# EAGLE design pro-one-filter-and-envelopes (EAGLE 5.07)
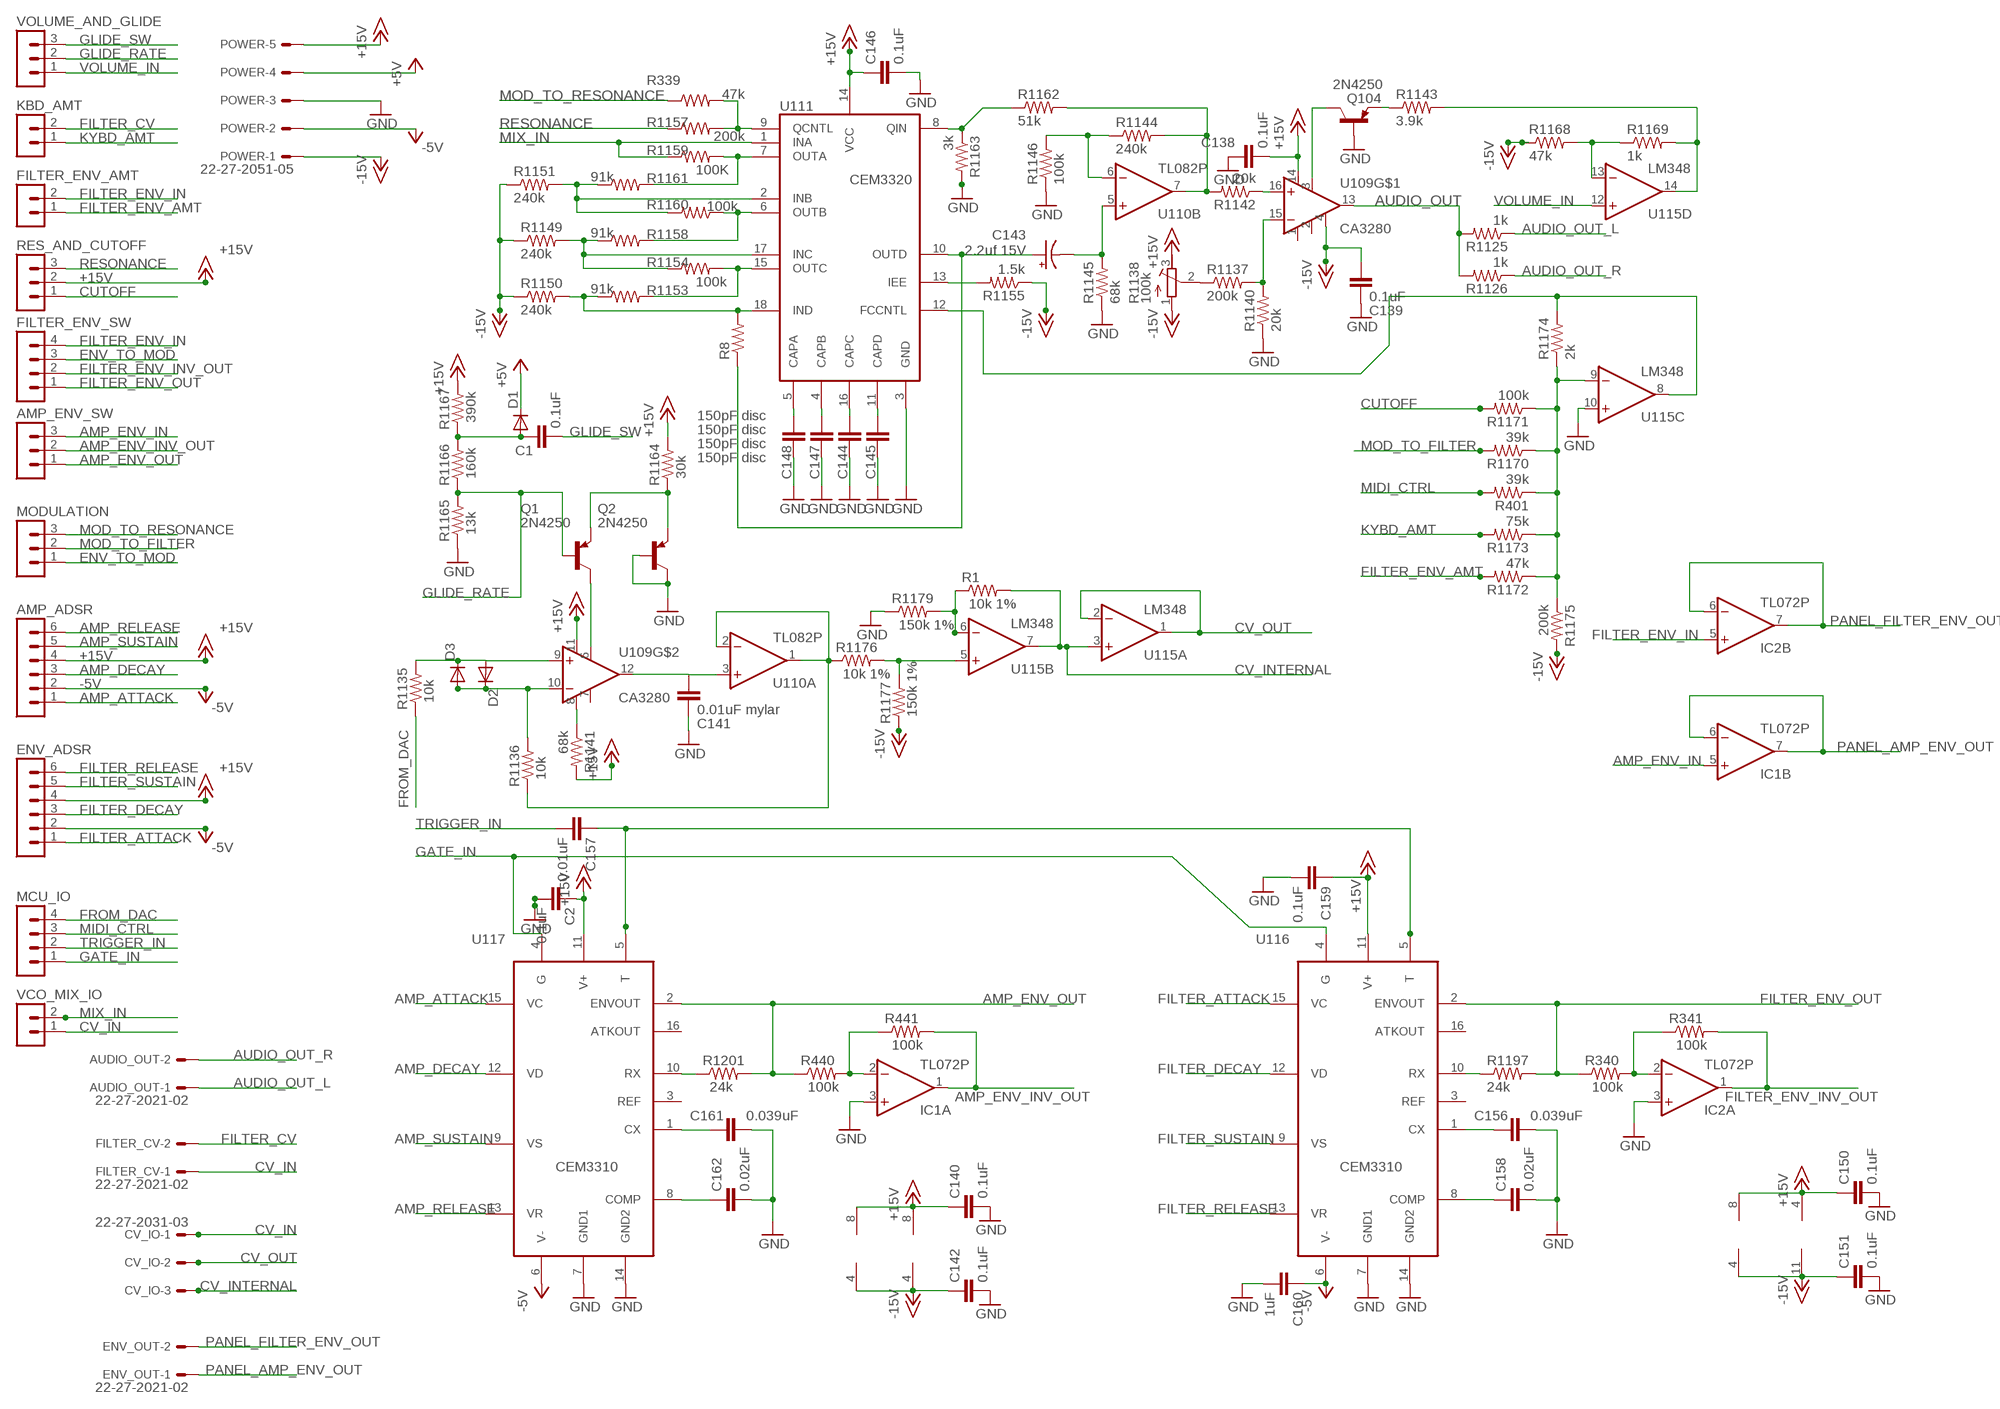
[diagram p0: schematic, sheet 1]

## Parts
AMP_ADSR  MA06-1  [MA06-1]
AMP_ENV_SW  MA03-1  [MA03-1]
AUDIO_OUT  22-27-2021-02  [6410-02]
C1  0.1uF  C-EU050-025X075  [C050-025X075]
C2  0.1uF  C-EU050-025X075  [C050-025X075]
C138  0.1uF  C-EU050-025X075  [C050-025X075]
C139  0.1uF  C-EU050-025X075  [C050-025X075]
C140  0.1uF  C-EU050-025X075  [C050-025X075]
C141  0.01uF mylar  C-EU050-025X075  [C050-025X075]
C142  0.1uF  C-EU050-025X075  [C050-025X075]
C143  2.2uf 15V  CPOL-USE2.5-5  [E2,5-5]
C144  150pF disc  C-EU025-025X050  [C025-025X050]
C145  150pF disc  C-EU025-025X050  [C025-025X050]
C146  0.1uF  C-EU025-025X050  [C025-025X050]
C147  150pF disc  C-EU025-025X050  [C025-025X050]
C148  150pF disc  C-EU025-025X050  [C025-025X050]
C150  0.1uF  C-EU050-025X075  [C050-025X075]
C151  0.1uF  C-EU050-025X075  [C050-025X075]
C156  0.039uF  C-EU050-025X075  [C050-025X075]
C157  0.01uF  C-EU050-025X075  [C050-025X075]
C158  0.02uF  C-EU050-025X075  [C050-025X075]
C159  0.1uF  C-EU050-025X075  [C050-025X075]
C160  1uF  C-EU050-025X075  [C050-025X075]
C161  0.039uF  C-EU050-025X075  [C050-025X075]
C162  0.02uF  C-EU050-025X075  [C050-025X075]
CV_IO  22-27-2031-03  [6410-03]
D1  1N4148DO35-7  [DO35-7]
D2  1N4148DO35-10  [DIODE_STANDING]
D3  1N4148DO35-10  [DIODE_STANDING]
ENV_ADSR  MA06-1  [MA06-1]
ENV_OUT  22-27-2021-02  [6410-02]
FILTER_CV  22-27-2021-02  [6410-02]
FILTER_ENV_AMT  MA02-1  [MA02-1]
FILTER_ENV_SW  MA04-1  [MA04-1]
IC1  TL072P  [DIL08]
IC2  TL072P  [DIL08]
KBD_AMT  MA02-1  [MA02-1]
MCU_IO  MA04-1  [MA04-1]
MODULATION  MA03-1  [MA03-1]
POWER  22-27-2051-05  [6410-05]
Q1  2N4250  [TO92]
Q2  2N4250  [TO92]
Q104  2N4250  [TO92]
R1  10k 1%  R-US_0204/2V  [0204V]
R8  R-US_0204/5  [0204/5]
R339  47k  R-US_0309/10  [0309/10]
R340  100k  R-US_0309/10  [0309/10]
R341  100k  R-US_0309/10  [0309/10]
R401  39k  R-US_0309/10  [0309/10]
R440  100k  R-US_0309/10  [0309/10]
R441  100k  R-US_0309/10  [0309/10]
R1125  1k  R-US_0204/2V  [0204V]
R1126  1k  R-US_0204/2V  [0204V]
R1135  10k  R-US_0204/2V  [0204V]
R1136  10k  R-US_0309/10  [0309/10]
R1137  200k  R-US_0204/2V  [0204V]
R1138  100k  R-TRIMM64W  [RTRIM64W]
R1140  20k  R-US_0204/2V  [0204V]
R1141  68k  R-US_0309/10  [0309/10]
R1142  20k  R-US_0309/10  [0309/10]
R1143  3.9k  R-US_0309/10  [0309/10]
R1144  240k  R-US_0204/2V  [0204V]
R1145  68k  R-US_0204/5  [0204/5]
R1146  100k  R-US_0204/5  [0204/5]
R1149  240k  R-US_0204/2V  [0204V]
R1150  240k  R-US_0204/2V  [0204V]
R1151  240k  R-US_0204/2V  [0204V]
R1153  91k  R-US_0204/2V  [0204V]
R1154  100k  R-US_0204/2V  [0204V]
R1155  1.5k  R-US_0204/5  [0204/5]
R1157  200k  R-US_0204/5  [0204/5]
R1158  91k  R-US_0309/10  [0309/10]
R1159  100K  R-US_0204/2V  [0204V]
R1160  100k  R-US_0204/2V  [0204V]
R1161  91k  R-US_0204/2V  [0204V]
R1162  51k  R-US_0309/10  [0309/10]
R1163  3k  R-US_0204/2V  [0204V]
R1164  30k  R-US_0309/10  [0309/10]
R1165  13k  R-US_0309/10  [0309/10]
R1166  160k  R-US_0309/10  [0309/10]
R1167  390k  R-US_0309/10  [0309/10]
R1168  47k  R-US_0204/2V  [0204V]
R1169  1k  R-US_0204/2V  [0204V]
R1170  39k  R-US_0309/10  [0309/10]
R1171  100k  R-US_0309/10  [0309/10]
R1172  47k  R-US_0204/2V  [0204V]
R1173  75k  R-US_0309/10  [0309/10]
R1174  2k  R-US_0204/2V  [0204V]
R1175  200k  R-US_0309/10  [0309/10]
R1176  10k 1%  R-US_0309/10  [0309/10]
R1177  150k 1%  R-US_0204/2V  [0204V]
R1179  150k 1%  R-US_0309/10  [0309/10]
R1197  24k  R-US_0204/2V  [0204V]
R1201  24k  R-US_0309/10  [0309/10]
RES_AND_CUTOFF  MA03-1  [MA03-1]
U109  CA3280  [DIL16]
U110  TL082P  [DIL08]
U111  CEM3320  [DIL18]
U115  LM348  [DIL14]
U116  CEM3310  [DIL16]
U117  CEM3310  [DIL16]
VCO_MIX_IO  MA02-1  [MA02-1]
VOLUME_AND_GLIDE  MA03-1  [MA03-1]

## Nets
+5V: D1.C POWER.4
+15V: AMP_ADSR.4 C2.1 C138.2 C140.1 C146.1 C150.1 C159.1 ENV_ADSR.4 IC1.8(P:V+) IC2.8(P:V+) POWER.5 R1138.3(A) R1141.2 R1164.2 R1167.2 RES_AND_CUTOFF.2 U109.11(V+) U109.14(V+) U110.8(P:V+) U111.14(VCC) U115.4(P:V+) U116.11(V+) U117.11(V+)
-5V: AMP_ADSR.2 C160.1 ENV_ADSR.2 POWER.2 U116.6(V-) U117.6(V-)
-15V: C139.1 C142.1 C151.1 IC1.4(P:V-) IC2.4(P:V-) POWER.1 R1138.1(E) R1149.1 R1150.1 R1151.1 R1155.1 R1168.1 R1175.2 R1177.1 U109.4(V-) U110.4(P:V-) U115.11(P:V-)
AMP_ATTACK: AMP_ADSR.1 U117.15(VC)
AMP_DECAY: AMP_ADSR.3 U117.12(VD)
AMP_ENV_IN: AMP_ENV_SW.3 IC1.5(B:+IN)
AMP_ENV_INV_OUT: AMP_ENV_SW.2 IC1.1(A:OUT) R441.2
AMP_ENV_OUT: AMP_ENV_SW.1 R440.1 R1201.2 U117.2(ENVOUT)
AMP_RELEASE: AMP_ADSR.6 U117.13(VR)
AMP_SUSTAIN: AMP_ADSR.5 U117.9(VS)
AUDIO_OUT: R1125.2 R1126.2 U109.13(OUT)
AUDIO_OUT_L: AUDIO_OUT.1 R1125.1
AUDIO_OUT_R: AUDIO_OUT.2 R1126.1
CUTOFF: R1171.2 RES_AND_CUTOFF.1
CV_IN: CV_IO.1 FILTER_CV.1 VCO_MIX_IO.1
CV_INTERNAL: CV_IO.3 R1.2 U115.3(A:+IN) U115.7(B:OUT)
CV_OUT: CV_IO.2 U115.1(A:OUT) U115.2(A:-IN)
ENV_TO_MOD: FILTER_ENV_SW.3 MODULATION.1
FILTER_ATTACK: ENV_ADSR.1 U116.15(VC)
FILTER_CV: FILTER_CV.2 KBD_AMT.2
FILTER_DECAY: ENV_ADSR.3 U116.12(VD)
FILTER_ENV_AMT: FILTER_ENV_AMT.1 R1172.2
FILTER_ENV_IN: FILTER_ENV_AMT.2 FILTER_ENV_SW.4 IC2.5(B:+IN)
FILTER_ENV_INV_OUT: FILTER_ENV_SW.2 IC2.1(A:OUT) R341.2
FILTER_ENV_OUT: FILTER_ENV_SW.1 R340.1 R1197.2 U116.2(ENVOUT)
FILTER_RELEASE: ENV_ADSR.6 U116.13(VR)
FILTER_SUSTAIN: ENV_ADSR.5 U116.9(VS)
FROM_DAC: MCU_IO.4 R1135.1
GATE_IN: MCU_IO.1 U116.4(G) U117.4(G)
GLIDE_RATE: Q1.2(B) R1165.2 R1166.1 VOLUME_AND_GLIDE.2
GLIDE_SW: C1.2 VOLUME_AND_GLIDE.3
GND: C2.2 C138.1 C139.2 C140.2 C141.2 C142.2 C144.2 C145.2 C146.2 C147.2 C148.2 C150.2 C151.2 C156.2 C158.2 C159.2 C160.2 C161.2 C162.2 IC1.3(A:+IN) IC2.3(A:+IN) POWER.3 Q2.1(C) Q2.2(B) Q104.2(B) R1140.1 R1145.1 R1146.1 R1163.2 R1165.1 R1179.1 U111.3(GND) U115.10(C:+IN) U116.7(GND1) U116.14(GND2) U117.7(GND1) U117.14(GND2)
KYBD_AMT: KBD_AMT.1 R1173.2
MIDI_CTRL: MCU_IO.3 R401.2
MIX_IN: R1159.1 U111.1(INA) VCO_MIX_IO.2
MOD_TO_FILTER: MODULATION.2 R1170.2
MOD_TO_RESONANCE: MODULATION.3 R339.1
N$1: R339.2 R1157.2 U111.9(QCNTL)
N$2: C148.1 U111.5(CAPA)
N$3: R1159.2 R1161.2 U111.7(OUTA)
N$4: R1151.2 R1160.2 R1161.1 U111.2(INB)
N$5: R1158.2 R1160.1 U111.6(OUTB)
N$6: R1149.2 R1154.1 R1158.1 U111.17(INC)
N$7: R1153.2 R1154.2 U111.15(OUTC)
N$8: C147.1 U111.4(CAPB)
N$9: R8.2 R1150.2 R1153.1 U111.18(IND)
N$10: C144.1 U111.16(CAPC)
N$11: C145.1 U111.11(CAPD)
N$12: R1162.1 R1163.1 U111.8(QIN)
N$13: C143.- R1145.2 U110.5(B:+IN)
N$14: R1142.2 R1144.2 R1162.2 U110.7(B:OUT)
N$15: R1144.1 R1146.2 U110.6(B:-IN)
N$16: R1137.2 R1140.2 U109.15(-IN)
N$17: C143.+ R8.1 U111.10(OUTD)
N$18: R1155.2 U111.13(IEE)
N$19: R1142.1 U109.16(+IN)
N$20: R1137.1 R1138.2(S)
N$21: R1141.1 U109.8(ID)
N$22: Q104.1(C) U109.3(IABC)
N$23: Q104.3(E) R1143.1
N$24: C162.1 U117.8(COMP)
N$25: C161.1 U117.1(CX)
N$26: R1168.2 R1169.1 U115.13(D:-IN)
N$27: R1201.1 U117.10(RX)
N$28: IC1.2(A:-IN) R440.2 R441.1
N$29: C157.1 U116.5(T) U117.5(T)
N$30: IC2.2(A:-IN) R340.2 R341.1
N$31: C141.1 U109.12(OUT) U110.3(A:+IN)
N$32: R1197.1 U116.10(RX)
N$33: C156.1 U116.1(CX)
N$34: C158.1 U116.8(COMP)
N$35: Q1.1(C) U109.6(IABC)
N$36: R1136.1 R1176.1 U110.1(A:OUT) U110.2(A:-IN)
N$37: R401.1 R1170.1 R1171.1 R1172.1 R1173.1 R1174.1 R1175.1 U115.9(C:-IN)
N$38: R1176.2 R1177.2 U115.5(B:+IN)
N$39: R1174.2 U111.12(FCCNTL) U115.8(C:OUT)
N$40: R1.1 R1179.2 U115.6(B:-IN)
N$42: D2.A D3.C R1135.2 U109.9(+IN)
N$43: Q1.3(E) Q2.3(E) R1164.1
N$45: C1.1 D1.A R1166.2 R1167.1
N$46: D2.C D3.A R1136.2 U109.10(-IN)
PANEL_AMP_ENV_OUT: ENV_OUT.1 IC1.6(B:-IN) IC1.7(B:OUT)
PANEL_FILTER_ENV_OUT: ENV_OUT.2 IC2.6(B:-IN) IC2.7(B:OUT)
RESONANCE: R1157.1 RES_AND_CUTOFF.3
TRIGGER_IN: C157.2 MCU_IO.2
VOLUME_CTRL: R1143.2 R1169.2 U115.14(D:OUT)
VOLUME_IN: U115.12(D:+IN) VOLUME_AND_GLIDE.1
Unconnected: U109.1(ID) U109.2(EMITTER) U109.7(EMITTER) U116.3(REF) U116.16(ATKOUT) U117.3(REF) U117.16(ATKOUT)

## Library data of the parts
AMP_ADSR ENV_ADSR = con-lstb:MA06-1: PIN HEADER
AMP_ENV_SW MODULATION RES_AND_CUTOFF VOLUME_AND_GLIDE = con-lstb:MA03-1: PIN HEADER
AUDIO_OUT ENV_OUT FILTER_CV = con-molex:22-?-02: CONNECTOR wire to board 2.54 mm (.1 inch) pitch header
C1 C2 C138-C142 C144-C148 C150 C151 C156-C162 = resistor:C-EU: CAPACITOR, European symbol
C143 = rcl:CPOL-US: POLARIZED CAPACITOR, American symbol
CV_IO = con-molex:22-?-03: CONNECTOR wire to board 2.54 mm (.1 inch) pitch header
D1 = diode:1N4148: DIODE high speed (Philips)
D2 D3 = joakim:1N4148: DIODE high speed (Philips)
FILTER_ENV_AMT KBD_AMT VCO_MIX_IO = joakim:MA02-1: PIN HEADER
FILTER_ENV_SW MCU_IO = con-lstb:MA04-1: PIN HEADER
IC1 IC2 = joakim:TL072: OP AMP
POWER = con-molex:22-?-05: CONNECTOR wire to board 2.54 mm (.1 inch) pitch header
Q1 Q2 Q104 = joakim:2N4250: PNP Transistor
R1 R8 R339-R341 R401 R440 R441 R1125 R1126 R1135-R1137 R1140-R1146 R1149-R1151 R1153-R1155 R1157-R1177 R1179 R1197 R1201 = resistor:R-US_: RESISTOR, American symbol
R1138 = resistor:R-TRIMM: Trimm resistor
U109 = joakim:CA3280: Dual opamp
U110 = joakim:TL082: OP AMP
U111 = joakim:CEM3320: Voltage Controlled Filter for musical synthesizers
U115 = joakim:LM348: Quad General Purpose, Low Voltage, Operational Amplifiers
U116 U117 = joakim:CEM3310: Voltage Controlled Oscillator for musical synthesizers

## Board
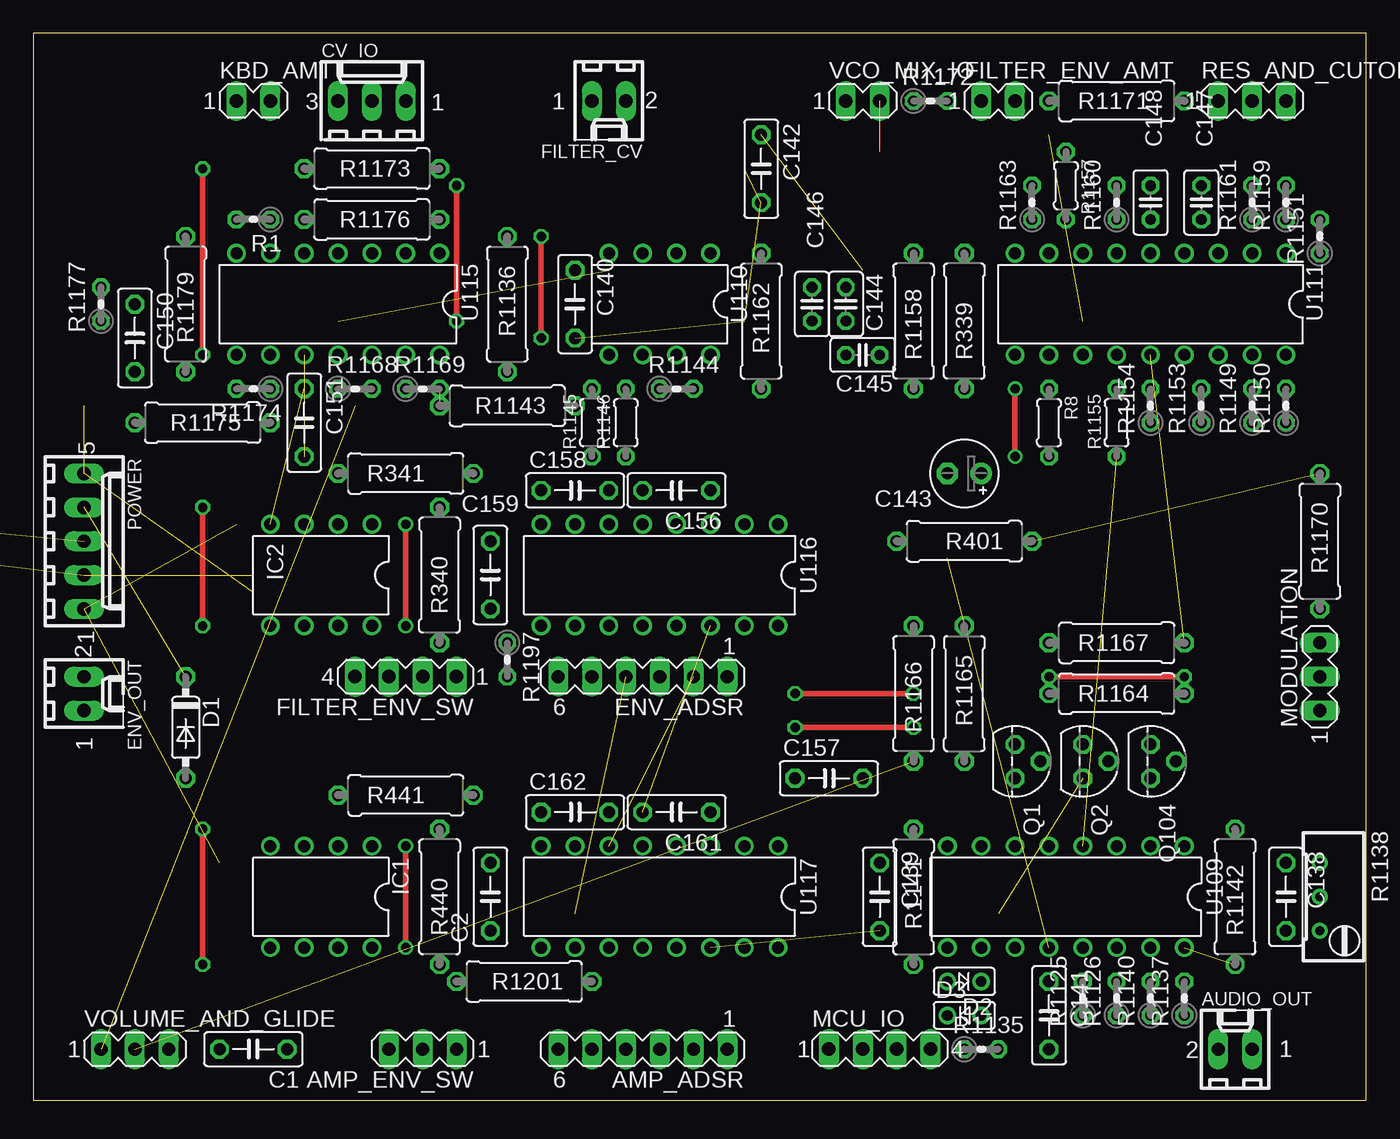
[diagram p1: board, top side]
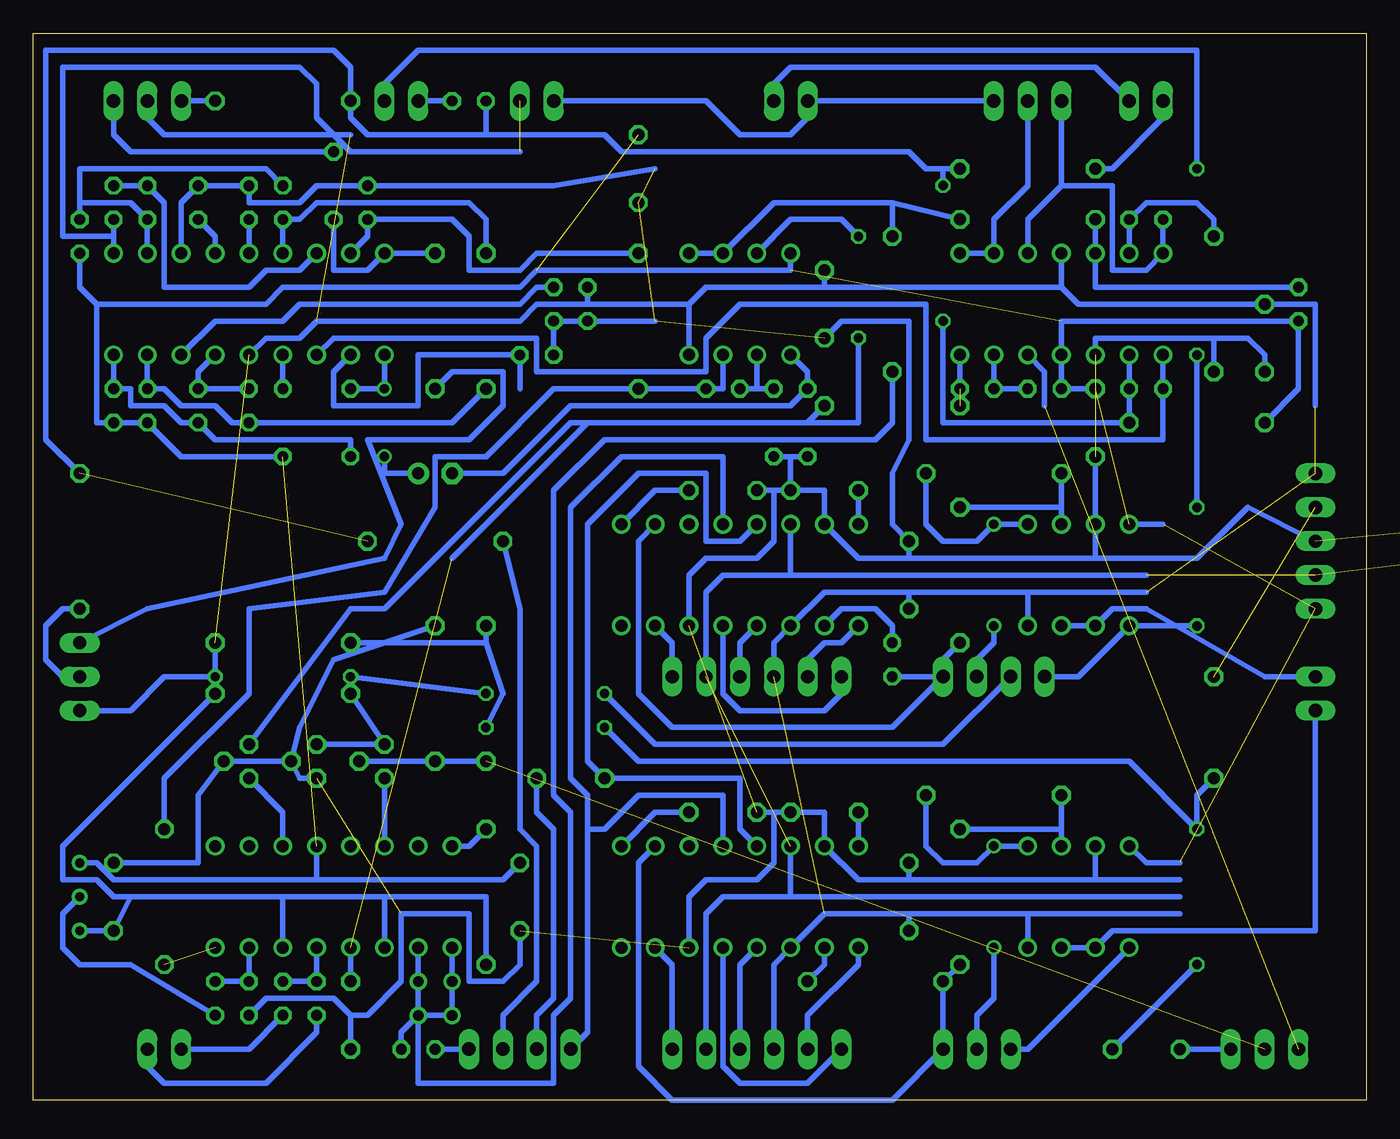
[diagram p2: board, bottom side, seen from below]

Size 100 x 80 mm. Coordinates in mm from the lower left corner, seen from the top.
Outline: 0,0 100,0 100,80 0,80 0,0
Copper layers (1*16): Top 0.035mm / dielectric 1.5mm / Bottom 0.035mm
Design rules "default": minimum track width 10mil, minimum drill 24mil, track to track 8mil, track to pad 8mil, pad to pad 8mil, via to via 8mil, smd to smd 8mil, copper to edge 40mil, drill to drill 8mil, minimum pad ring 10mil, minimum via ring 8mil, stop-mask expansion 4mil, vias tented up to drill 0mil, thermal gap 10mil

### Footprints (pad centres in the part's own frame; a part is rotated, then mirrored left to right if it is on the bottom)
MA06-1 = drill 1 long: 1 -6.35,0; 2 -3.81,0; 3 -1.27,0; 4 1.27,0; 5 3.81,0; 6 6.35,0
MA03-1 = drill 1 long: 1 -2.54,0; 2 0,0; 3 2.54,0
6410-02 = drill 1 long: 1 1.27,0; 2 -1.27,0
C050-025X075 = drill 0.9 octagon: 1 -2.54,0; 2 2.54,0
E2,5-5 = drill 0.9 pad 1.6 round: + -1.27,0 | drill 0.9 pad 1.6 octagon: - 1.27,0
C025-025X050 = drill 0.813 octagon: 1 -1.27,0; 2 1.27,0
6410-03 = drill 1 long: 1 2.54,0; 2 0,0; 3 -2.54,0
DO35-7 = drill 0.9 octagon: A 3.81,0; C -3.81,0
DIODE_STANDING = drill 0.8 round: A 1.27,0; C -1.27,0
MA02-1 = drill 1 long: 1 -2.54,0; 2 0,0
MA04-1 = drill 1.016 long: 1 -3.81,0; 2 -1.27,0; 3 1.27,0; 4 3.81,0
DIL08 = drill 0.9 round: 1 -3.81,-3.81; 2 -1.27,-3.81; 3 1.27,-3.81; 4 3.81,-3.81; 5 3.81,3.81; 6 1.27,3.81; 7 -1.27,3.81; 8 -3.81,3.81
6410-05 = drill 1 long: 1 5.08,0; 2 2.54,0; 3 0,0; 4 -2.54,0; 5 -5.08,0
TO92 = drill 0.9 octagon: 1 1.27,0; 2 0,1.905; 3 -1.27,0
0204V = drill 0.813 octagon: 1 -1.27,0; 2 1.27,0
0204/5 = drill 0.813 octagon: 1 -2.54,0; 2 2.54,0
0309/10 = drill 0.9 octagon: 1 -5.08,0; 2 5.08,0
RTRIM64W = drill 0.7 round: 1 1.27,-2.54; 2 1.27,0; 3 1.27,2.54
DIL16 = drill 0.9 round: 1 -8.89,-3.81; 2 -6.35,-3.81; 3 -3.81,-3.81; 4 -1.27,-3.81; 5 1.27,-3.81; 6 3.81,-3.81; 7 6.35,-3.81; 8 8.89,-3.81; 9 8.89,3.81; 10 6.35,3.81; 11 3.81,3.81; 12 1.27,3.81; 13 -1.27,3.81; 14 -3.81,3.81; 15 -6.35,3.81; 16 -8.89,3.81
DIL18 = drill 0.9 round: 1 -10.16,-3.81; 2 -7.62,-3.81; 3 -5.08,-3.81; 4 -2.54,-3.81; 5 0,-3.81; 6 2.54,-3.81; 7 5.08,-3.81; 8 7.62,-3.81; 9 10.16,-3.81; 10 10.16,3.81; 11 7.62,3.81; 12 5.08,3.81; 13 2.54,3.81; 14 0,3.81; 15 -2.54,3.81; 16 -5.08,3.81; 17 -7.62,3.81; 18 -10.16,3.81
DIL14 = drill 0.9 round: 1 -7.62,-3.81; 2 -5.08,-3.81; 3 -2.54,-3.81; 4 0,-3.81; 5 2.54,-3.81; 6 5.08,-3.81; 7 7.62,-3.81; 8 7.62,3.81; 9 5.08,3.81; 10 2.54,3.81; 11 0,3.81; 12 -2.54,3.81; 13 -5.08,3.81; 14 -7.62,3.81

### Placement (x,y rotation side)
AMP_ADSR  45.72,3.81 180 top
AMP_ENV_SW  29.21,3.81 180 top
AUDIO_OUT  90.17,3.81 0 top
C1  16.51,3.81 180 top
C2  34.29,15.24 90 top
C138  93.98,15.24 270 top
C139  63.5,15.24 270 top
C140  40.64,59.69 270 top
C141  76.2,6.35 270 top
C142  54.61,69.85 270 top
C143  69.85,46.99 180 top
C144  60.96,59.69 270 top
C145  62.23,55.88 180 top
C146  58.42,59.69 270 top
C147  87.63,67.31 90 top
C148  83.82,67.31 90 top
C150  7.62,57.15 270 top
C151  20.32,50.8 270 top
C156  48.26,45.72 180 top
C157  59.69,24.13 0 top
C158  40.64,45.72 0 top
C159  34.29,39.37 90 top
C160  -78.74,49.53 0 top  (outside the outline)
C161  48.26,21.59 180 top
C162  40.64,21.59 0 top
CV_IO  25.4,74.93 0 top
D1  11.43,27.94 270 top
D2  69.85,8.89 180 top
D3  69.85,6.35 0 top
ENV_ADSR  45.72,31.75 180 top
ENV_OUT  3.81,30.48 270 top
FILTER_CV  43.18,74.93 180 top
FILTER_ENV_AMT  73.66,74.93 0 top
FILTER_ENV_SW  27.94,31.75 180 top
IC1  21.59,15.24 180 top
IC2  21.59,39.37 180 top
KBD_AMT  17.78,74.93 0 top
MCU_IO  63.5,3.81 0 top
MODULATION  96.52,31.75 90 top
POWER  3.81,41.91 270 top
Q1  73.66,25.4 270 top
Q2  78.74,25.4 270 top
Q104  83.82,25.4 270 top
R1  16.51,66.04 180 top
R8  76.2,50.8 270 top
R339  69.85,58.42 90 top
R340  30.48,39.37 90 top
R341  27.94,46.99 0 top
R401  69.85,41.91 180 top
R440  30.48,15.24 90 top
R441  27.94,22.86 0 top
R1125  78.74,7.62 90 top
R1126  81.28,7.62 90 top
R1135  71.12,3.81 0 top
R1136  35.56,59.69 270 top
R1137  86.36,7.62 90 top
R1138  97.79,15.24 180 top
R1140  83.82,7.62 90 top
R1141  66.04,15.24 270 top
R1142  90.17,15.24 90 top
R1143  35.56,52.07 180 top
R1144  48.26,53.34 0 top
R1145  41.91,50.8 90 top
R1146  44.45,50.8 90 top
R1149  91.44,52.07 90 top
R1150  93.98,52.07 90 top
R1151  96.52,64.77 90 top
R1153  87.63,52.07 90 top
R1154  83.82,52.07 90 top
R1155  81.28,50.8 90 top
R1157  77.47,68.58 270 top
R1158  66.04,58.42 90 top
R1159  93.98,67.31 90 top
R1160  81.28,67.31 90 top
R1161  91.44,67.31 90 top
R1162  54.61,58.42 270 top
R1163  74.93,67.31 90 top
R1164  81.28,30.48 0 top
R1165  69.85,30.48 270 top
R1166  66.04,30.48 90 top
R1167  81.28,34.29 0 top
R1168  24.13,53.34 0 top
R1169  29.21,53.34 0 top
R1170  96.52,41.91 270 top
R1171  81.28,74.93 0 top
R1172  67.31,74.93 0 top
R1173  25.4,69.85 180 top
R1174  16.51,53.34 180 top
R1175  12.7,50.8 180 top
R1176  25.4,66.04 180 top
R1177  5.08,59.69 90 top
R1179  11.43,59.69 90 top
R1197  35.56,33.02 270 top
R1201  36.83,8.89 180 top
RES_AND_CUTOFF  91.44,74.93 0 top
U109  77.47,15.24 180 top
U110  46.99,59.69 180 top
U111  83.82,59.69 180 top
U115  22.86,59.69 180 top
U116  46.99,39.37 180 top
U117  46.99,15.24 180 top
VCO_MIX_IO  63.5,74.93 0 top
VOLUME_AND_GLIDE  7.62,3.81 0 top

### Tracks (layer width: path | path; a pad name or v marks a point on that pad's centre or on a via)
+5V  (1 unrouted)
+15V  (5 unrouted)
  Bottom 0.406: 25.4,38.1 34.29,38.1 | 34.29,38.1 C159.1 | 34.29,38.1 40.64,38.1 U116.11 44.45,34.29 ENV_ADSR.4 | 25.4,38.1 IC2.8 | 16.51,38.1 25.4,38.1 | 13.97,13.97 25.4,13.97 | 25.4,13.97 IC1.8 | 25.4,13.97 34.29,13.97 | 34.29,13.97 40.64,13.97 U117.11 44.45,10.16 AMP_ADSR.4 | 34.29,13.97 C2.1 | U111.14 82.55,57.15 80.01,57.15 78.74,58.42 63.5,58.42 62.23,59.69 58.42,59.69 | 58.42,59.69 C146.1 | RES_AND_CUTOFF.2 91.44,73.66 90.17,72.39 76.2,72.39 | U110.8 50.8,59.69 | 50.8,59.69 58.42,59.69 | 73.66,15.24 81.28,15.24 | 81.28,15.24 92.71,15.24 | 81.28,15.24 U109.14 | 22.86,60.96 U115.4 | 22.86,60.96 21.59,59.69 C150.1 3.81,59.69 3.81,52.07 | 22.86,60.96 40.64,60.96 | 40.64,60.96 49.53,60.96 50.8,59.69 | 40.64,60.96 C140.1 | R1167.2 R1164.2 97.79,19.05 97.79,16.51 95.25,16.51 93.98,15.24 92.71,15.24 | 92.71,15.24 C138.2 R1138.3 | 73.66,15.24 U109.11 | 73.66,15.24 66.04,15.24 R1141.2
-5V  (3 unrouted)
  Bottom 0.406: 43.18,39.37 U116.6 | 16.51,39.37 43.18,39.37 | 43.18,15.24 U117.6 | 13.97,15.24 43.18,15.24 | AMP_ADSR.2 49.53,13.97 48.26,15.24 43.18,15.24 | 43.18,39.37 48.26,39.37 49.53,38.1 ENV_ADSR.2
-15V  (6 unrouted)
  Bottom 0.406: 15.24,43.18 IC2.4 | IC1.4 16.51,17.78 13.97,17.78 | 95.25,50.8 95.25,59.69 | 95.25,59.69 96.52,60.96 R1151.1 | 95.25,59.69 95.25,50.8 | 95.25,59.69 82.55,59.69 81.28,60.96 63.5,60.96 62.23,62.23 43.18,62.23 U110.4 | R1155.1 88.9,48.26 R1149.1 R1150.1 95.25,50.8 | R1177.1 22.86,58.42 U115.11 R1168.1 C151.1 | R1177.1 10.16,58.42 | 78.74,16.51 64.77,16.51 C139.1 | 78.74,16.51 U109.4 | 78.74,16.51 93.98,16.51 95.25,17.78 R1138.1 | R1177.1 5.08,53.34 R1175.2
AMP_ATTACK
  Bottom 0.406: U117.15 52.07,10.16 AMP_ADSR.1
AMP_DECAY
  Bottom 0.406: U117.12 46.99,10.16 AMP_ADSR.3
AMP_ENV_IN
  Bottom 0.406: IC1.5 25.4,3.81 AMP_ENV_SW.3
AMP_ENV_INV_OUT  (via drill 0.7)
  Top 0.406: v27.94,11.43 v27.94,19.05
  Bottom 0.406: IC1.1 v27.94,19.05 29.21,17.78 31.75,17.78 33.02,19.05 R441.2 | v27.94,11.43 27.94,7.62 29.21,6.35 AMP_ENV_SW.2
AMP_ENV_OUT
  Bottom 0.406: U117.2 54.61,17.78 54.61,2.54 52.07,0 35.56,0 AMP_ENV_SW.1 R1201.2 R440.1
AMP_RELEASE
  Bottom 0.406: AMP_ADSR.6 41.91,1.27 46.99,1.27 48.26,2.54 U117.13
AMP_SUSTAIN
  Bottom 0.406: U117.9 38.1,10.16 41.91,6.35 AMP_ADSR.5
AUDIO_OUT
  Bottom 0.406: R1126.2 R1125.2 U109.13
AUDIO_OUT_L
  Bottom 0.406: R1125.1 78.74,5.08 82.55,1.27 90.17,1.27 91.44,2.54 AUDIO_OUT.1
AUDIO_OUT_R
  Bottom 0.406: R1126.1 83.82,3.81 AUDIO_OUT.2
CUTOFF
  Bottom 0.406: RES_AND_CUTOFF.1 R1171.2
CV_IN
  Bottom 0.406: CV_IO.1 FILTER_CV.1 41.91,73.66 43.18,72.39 46.99,72.39 49.53,74.93 VCO_MIX_IO.1
CV_INTERNAL
  Bottom 0.406: U115.3 25.4,66.04 22.86,68.58 | 22.86,68.58 19.05,68.58 19.05,62.23 16.51,62.23 U115.7 R1.2 | 22.86,68.58 CV_IO.3
CV_OUT
  Bottom 0.406: U115.1 U115.2 27.94,66.04 25.4,68.58 CV_IO.2
ENV_TO_MOD  (via drill 0.7)
  Top 0.406: v57.15,30.48 v66.04,30.48 | v76.2,31.75 v86.36,31.75
  Bottom 0.406: FILTER_ENV_SW.3 31.75,26.67 53.34,26.67 v57.15,30.48 | v66.04,30.48 v76.2,31.75 | v86.36,31.75 90.17,31.75 92.71,29.21 MODULATION.1
FILTER_ATTACK
  Bottom 0.406: U116.15 52.07,34.29 ENV_ADSR.1
FILTER_CV
  Bottom 0.406: KBD_AMT.2 20.32,77.47 43.18,77.47 44.45,76.2 FILTER_CV.2
FILTER_DECAY
  Bottom 0.406: ENV_ADSR.3 46.99,34.29 U116.12
FILTER_ENV_AMT
  Bottom 0.406: FILTER_ENV_AMT.1 R1172.2
FILTER_ENV_IN  (via drill 0.7)
  Top 0.406: v12.7,35.56 v12.7,44.45 | v12.7,55.88 v12.7,69.85
  Bottom 0.406: FILTER_ENV_SW.4 21.59,31.75 IC2.5 v12.7,35.56 | v12.7,44.45 v12.7,55.88 | v12.7,69.85 12.7,78.74 71.12,78.74 73.66,76.2 FILTER_ENV_AMT.2
FILTER_ENV_INV_OUT  (via drill 0.7)
  Top 0.406: v27.94,35.56 v27.94,43.18
  Bottom 0.406: IC2.1 v27.94,43.18 29.21,41.91 31.75,41.91 33.02,43.18 R341.2 | v27.94,35.56 27.94,34.29 29.21,33.02 FILTER_ENV_SW.2
FILTER_ENV_OUT
  Bottom 0.406: FILTER_ENV_SW.1 35.56,27.94 52.07,27.94 54.61,30.48 54.61,41.91 U116.2 | FILTER_ENV_SW.1 31.75,33.02 R340.1 | FILTER_ENV_SW.1 R1197.2
FILTER_RELEASE
  Bottom 0.406: U116.13 48.26,30.48 46.99,29.21 40.64,29.21 39.37,30.48 ENV_ADSR.6
FILTER_SUSTAIN
  Bottom 0.406: U116.9 39.37,34.29 40.64,34.29 41.91,33.02 ENV_ADSR.5
FROM_DAC
  Bottom 0.406: MCU_IO.4 R1135.1
GATE_IN
  Bottom 0.406: U116.4 48.26,48.26 55.88,48.26 59.69,44.45 59.69,24.13 58.42,22.86 58.42,20.32 | U117.4 48.26,22.86 54.61,22.86 57.15,20.32 58.42,20.32 | MCU_IO.1 58.42,5.08 58.42,20.32
GLIDE_RATE  (1 unrouted)
  Bottom 0.406: Q1.2 R1165.2 R1166.1
GLIDE_SW
  Bottom 0.406: VOLUME_AND_GLIDE.3 C1.2
GND  (8 unrouted)
  Bottom 0.406: POWER.3 8.89,44.45 12.7,40.64 20.32,40.64 | 20.32,40.64 IC2.3 C151.2 | 44.45,21.59 44.45,17.78 45.72,16.51 49.53,16.51 50.8,15.24 U117.14 | 13.97,16.51 20.32,16.51 | 20.32,16.51 IC1.3 | 20.32,40.64 34.29,40.64 | 34.29,40.64 38.1,40.64 U116.7 40.64,45.72 C158.2 | 34.29,40.64 C159.2 35.56,43.18 35.56,46.99 34.29,49.53 34.29,58.42 39.37,58.42 C140.2 | 20.32,16.51 34.29,16.51 | 34.29,16.51 38.1,16.51 U117.7 40.64,21.59 C162.2 44.45,21.59 | 34.29,16.51 C2.2 | U116.14 50.8,39.37 49.53,40.64 45.72,40.64 44.45,41.91 44.45,45.72 | 44.45,45.72 C156.2 | C158.2 44.45,45.72 | 44.45,21.59 C161.2 | 53.34,58.42 C146.2 C144.2 C145.2 | 53.34,69.85 60.96,68.58 R1163.2 78.74,68.58 80.01,67.31 83.82,67.31 C148.2 C147.2 88.9,67.31 U111.3 | U115.10 20.32,57.15 11.43,57.15 | 11.43,57.15 8.89,57.15 7.62,55.88 C150.2 | 11.43,57.15 R1179.1 | 43.18,48.26 R1146.1 | 43.18,48.26 R1145.1 | C158.2 43.18,48.26 | Q2.1 80.01,24.13 Q2.2 | Q2.2 Q104.2 87.63,22.86 87.63,17.78 C138.1 | Q2.2 80.01,27.94 77.47,33.02 R1165.1 | R1140.1 82.55,7.62 77.47,7.62 76.2,6.35 | 76.2,6.35 C141.2 | C139.2 63.5,10.16 64.77,8.89 67.31,8.89 67.31,13.97 72.39,13.97 72.39,8.89 74.93,6.35 76.2,6.35
KYBD_AMT
  Bottom 0.406: KBD_AMT.1 15.24,73.66 19.05,69.85 R1173.2
MIDI_CTRL
  Bottom 0.406: R401.2 63.5,36.83 63.5,20.32 62.23,19.05 62.23,8.89 64.77,6.35 MCU_IO.3
MIX_IN  (1 unrouted)
  Bottom 0.406: U111.1 93.98,64.77 | R1159.1 93.98,64.77 | 93.98,64.77 97.79,64.77 97.79,77.47 80.01,77.47 78.74,76.2 78.74,73.66 76.2,71.12 63.5,71.12
MOD_TO_FILTER
  Bottom 0.406: R1170.2 97.79,36.83 99.06,35.56 99.06,33.02 97.79,31.75 MODULATION.2
MOD_TO_RESONANCE
  Bottom 0.406: R339.1 68.58,54.61 64.77,54.61 64.77,52.07 67.31,49.53 74.93,49.53 72.39,43.18 73.66,40.64 91.44,36.83 MODULATION.3
N$1
  Bottom 0.406: R1157.2 77.47,62.23 74.93,62.23 U111.9 R339.2
N$2
  Bottom 0.406: U111.5 C148.1
N$3
  Bottom 0.406: R1159.2 R1161.2 90.17,67.31 90.17,60.96 83.82,60.96 82.55,62.23 80.01,62.23 U111.7
N$4
  Bottom 0.406: U111.2 R1161.1 92.71,67.31 96.52,67.31 | 96.52,67.31 R1151.2 | 96.52,67.31 96.52,69.85 82.55,69.85 R1160.2
N$5
  Bottom 0.406: R1158.2 66.04,66.04 67.31,67.31 78.74,67.31 80.01,66.04 R1160.1 U111.6
N$6
  Bottom 0.406: U111.17 R1149.2 90.17,53.34 88.9,52.07 86.36,52.07 85.09,50.8 R1154.1 68.58,50.8 R1158.1
N$7
  Bottom 0.406: R1154.2 R1153.2 87.63,54.61 U111.15
N$8
  Bottom 0.406: U111.4 86.36,64.77 C147.1
N$9
  Bottom 0.406: U111.18 R1150.2 92.71,53.34 92.71,52.07 90.17,52.07 88.9,50.8 R1153.1 86.36,49.53 76.2,49.53 R8.2
N$10
  Bottom 0.406: C144.1 62.23,60.96 63.5,59.69 80.01,59.69 81.28,58.42 86.36,58.42 U111.16
N$11
  Bottom 0.406: 63.5,53.34 C145.1 71.12,55.88 71.12,52.07 77.47,52.07 77.47,54.61 U111.11
N$12
  Bottom 0.406: U111.8 74.93,64.77 R1163.1 68.58,66.04 67.31,64.77 67.31,62.23 63.5,62.23 62.23,63.5 R1162.1
N$13
  Bottom 0.406: U110.5 41.91,54.61 R1145.2 43.18,52.07 59.69,52.07 64.77,46.99 C143.-
N$14
  Bottom 0.406: U110.7 48.26,53.34 R1144.2 R1162.2 60.96,53.34 66.04,48.26 69.85,48.26 69.85,44.45 73.66,38.1 83.82,36.83 83.82,30.48 90.17,24.13 R1142.2
N$15
  Bottom 0.406: R1146.2 45.72,53.34 | 45.72,53.34 U110.6 | 45.72,53.34 R1144.1
N$16
  Bottom 0.406: U109.15 R1140.2 R1137.2
N$17  (via drill 0.7)
  Top 0.406: v73.66,48.26 v73.66,53.34
  Bottom 0.406: U111.10 v73.66,53.34 R8.1 | C143.+ 73.66,46.99 v73.66,48.26
N$18
  Bottom 0.406: R1155.2 U111.13
N$19  (1 unrouted)
N$20
  Bottom 0.406: R1138.2 97.79,13.97 97.79,11.43 96.52,10.16 92.71,10.16 R1137.1
N$21
  Bottom 0.406: R1141.1 67.31,19.05 U109.8
N$22
  Bottom 0.406: Q104.1 81.28,21.59 U109.3
N$23
  Bottom 0.406: Q104.3 76.2,36.83 73.66,36.83 59.69,50.8 41.91,50.8 R1143.1
N$24
  Bottom 0.406: U117.8 C162.1
N$25
  Bottom 0.406: C161.1 53.34,21.59 U117.1
N$26
  Bottom 0.406: U115.13 R1169.1 R1168.2
N$27
  Bottom 0.406: U117.10 40.64,10.16 R1201.1
N$28
  Bottom 0.406: IC1.2 22.86,20.32 | 22.86,20.32 R440.2 | 22.86,20.32 R441.1
N$29
  Bottom 0.406: U117.5 46.99,20.32 46.99,24.13 C157.1 58.42,25.4 58.42,43.18 54.61,46.99 49.53,46.99 49.53,41.91 46.99,41.91 U116.5
N$30
  Bottom 0.406: IC2.2 22.86,44.45 | 22.86,44.45 R340.2 | 22.86,44.45 R341.1
N$31  (via drill 0.7)  (1 unrouted)
  Top 0.406: v38.1,57.15 v38.1,64.77
  Bottom 0.406: U110.3 43.18,66.04 39.37,66.04 v38.1,64.77 | v38.1,57.15 38.1,50.8 58.42,50.8 68.58,40.64 | C141.1 U109.12
N$32
  Bottom 0.406: U116.10 39.37,36.83 36.83,36.83 35.56,35.56 R1197.1
N$33
  Bottom 0.406: C156.1 53.34,45.72 U116.1
N$34
  Bottom 0.406: U116.8 C158.1
N$35
  Bottom 0.406: U109.6 Q1.1
N$36
  Bottom 0.406: U110.1 U110.2 44.45,67.31 35.56,67.31 | R1176.1 35.56,67.31 | 35.56,67.31 R1136.1
N$37  (via drill 0.7)  (1 unrouted)
  Top 0.406: v31.75,58.42 v31.75,68.58
  Bottom 0.406: 66.04,72.39 74.93,72.39 76.2,73.66 R1171.1 76.2,77.47 77.47,78.74 99.06,78.74 99.06,49.53 R1170.1 | 66.04,72.39 57.15,72.39 55.88,71.12 34.29,71.12 33.02,69.85 31.75,69.85 | 66.04,72.39 R1172.1 | 31.75,69.85 R1173.1 | R1175.1 R1174.1 U115.9 R1175.1 | R1175.1 31.75,50.8 v31.75,58.42 | v31.75,68.58 31.75,69.85
N$38
  Bottom 0.406: R1177.2 20.32,60.96 U115.5 R1176.2
N$39
  Bottom 0.406: U111.12 77.47,57.15 62.23,57.15 62.23,54.61 49.53,54.61 49.53,57.15 46.99,59.69 33.02,59.69 33.02,49.53 15.24,49.53 R1174.2 U115.8
N$40
  Bottom 0.406: U115.6 R1.1 16.51,67.31 12.7,67.31 11.43,66.04 R1179.2
N$42
  Bottom 0.406: U109.9 D2.A D3.C 71.12,6.35 72.39,5.08 R1135.2
N$43
  Bottom 0.406: Q2.3 Q1.3 R1164.1
N$45  (via drill 0.7)
  Top 0.406: v57.15,27.94 v66.04,27.94 | v12.7,10.16 v12.7,20.32
  Bottom 0.406: 66.04,34.29 R1166.2 | 66.04,34.29 R1167.1 | 66.04,34.29 64.77,30.48 v66.04,27.94 | v57.15,27.94 54.61,25.4 17.78,25.4 v12.7,20.32 12.7,22.86 D1.A | C1.1 v12.7,10.16
N$46
  Bottom 0.406: R1136.2 35.56,50.8 36.83,49.53 57.15,49.53 60.96,45.72 60.96,22.86 59.69,21.59 59.69,7.62 60.96,6.35 60.96,1.27 71.12,1.27 D3.A D2.C U109.10
PANEL_AMP_ENV_OUT
  Bottom 0.406: IC1.7 IC1.6 19.05,12.7 3.81,12.7 ENV_OUT.1
PANEL_FILTER_ENV_OUT
  Bottom 0.406: IC2.7 IC2.6 19.05,36.83 16.51,36.83 7.62,31.75 ENV_OUT.2
RESONANCE
  Bottom 0.406: R1157.1 92.71,71.12 93.98,72.39 RES_AND_CUTOFF.3
TRIGGER_IN
  Bottom 0.406: MCU_IO.2 62.23,6.35 60.96,7.62 60.96,20.32 62.23,21.59 C157.2
VOLUME_CTRL  (1 unrouted)
  Bottom 0.406: R1169.2 U115.14
VOLUME_IN  (1 unrouted)
  Bottom 0.406: U115.12 24.13,54.61 24.13,52.07